# EAGLE design 187 lamp wall Dec 2016 (EAGLE 7.1.0)
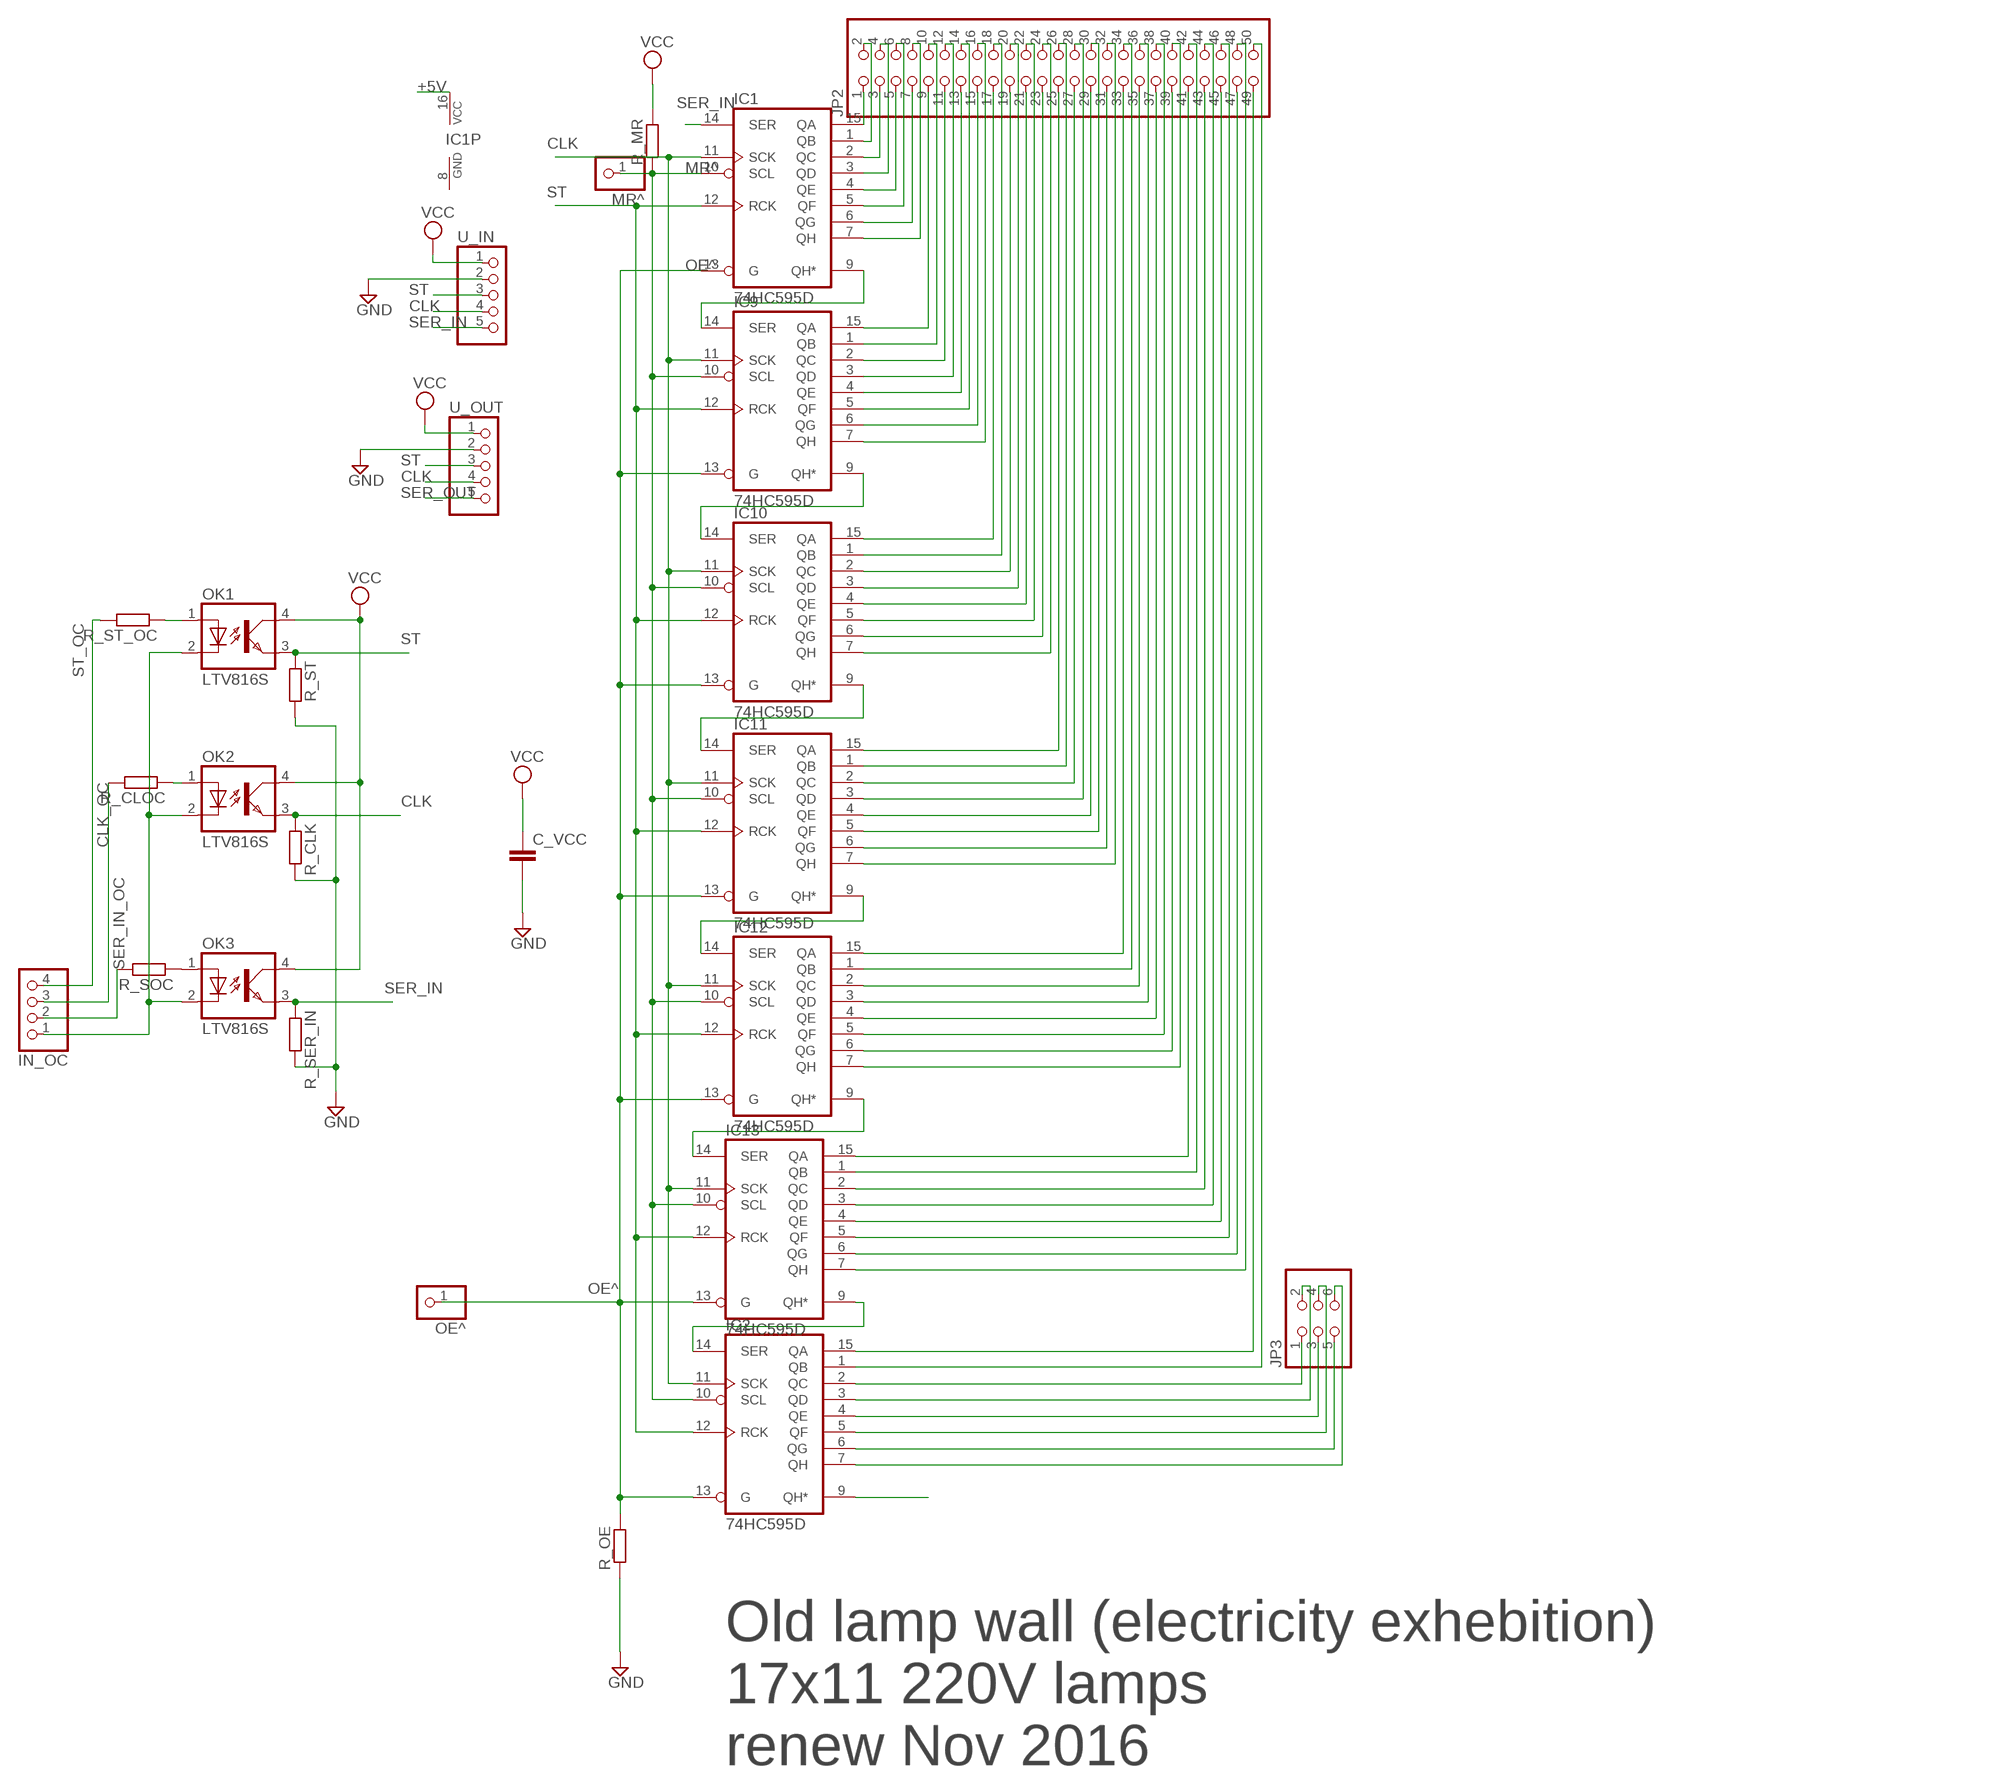
[diagram p0: schematic, sheet 1]

## Parts
C_VCC  C-EUC0603  [C0603]
IC1  74HC595D  [SO16]
IC2  74HC595D  [SO16]
IC9  74HC595D  [SO16]
IC10  74HC595D  [SO16]
IC11  74HC595D  [SO16]
IC12  74HC595D  [SO16]
IC13  74HC595D  [SO16]
IN_OC  PINHD-1X4SMALL_PADS  [1X4MARKED_SMALL]
JP2  PINHD-2X25  [2X25]
JP3  PINHD-2X3  [2X03]
MR^  PINHD-1X1  [1X01]
OE^  PINHD-1X1  [1X01]
OK1  LTV816S  [SMD4]
OK2  LTV816S  [SMD4]
OK3  LTV816S  [SMD4]
R_CLK  R-EU_R0603  [R0603]
R_CLOC  R-EU_R0603  [R0603]
R_MR  R-EU_R0603  [R0603]
R_OE  R-EU_R0603  [R0603]
R_SER_IN  R-EU_R0603  [R0603]
R_SOC  R-EU_R0603  [R0603]
R_ST  R-EU_R0603  [R0603]
R_ST_OC  R-EU_R0603  [R0603]
U_IN  PIN_HEAD_1X5_MARKEDSMAOLPAD  [1X5_MARKED_SMALL_PADS]
U_OUT  PIN_HEAD_1X5_MARKEDSMAOLPAD  [1X5_MARKED_SMALL_PADS]

## Nets
+5V: C_VCC.1 IC1.16(VCC) OK1.4(COL) OK2.4(COL) OK3.4(COL) R_MR.2 U_IN.1 U_OUT.1 ; supply symbol labelled VCC
CLK: IC1.11(SCK) IC2.11(SCK) IC9.11(SCK) IC10.11(SCK) IC11.11(SCK) IC12.11(SCK) IC13.11(SCK) OK2.3(EMIT) R_CLK.1 U_IN.4 U_OUT.4
CLK_OC: IN_OC.3 R_CLOC.2
GND: C_VCC.2 R_CLK.2 R_OE.1 R_SER_IN.2 R_ST.2 U_IN.2 U_OUT.2
MR^: IC1.10(SCL) IC2.10(SCL) IC9.10(SCL) IC10.10(SCL) IC11.10(SCL) IC12.10(SCL) IC13.10(SCL) MR^.1 R_MR.1
N$1: IC2.15(QA) JP2.49
N$2: IC2.1(QB) JP2.50
N$3: IC1.15(QA) JP2.1
N$4: IC2.2(QC) JP3.1
N$5: IC1.1(QB) JP2.2
N$6: IC2.3(QD) JP3.2
N$7: IC2.4(QE) JP3.3
N$8: IC2.5(QF) JP3.4
N$9: IC2.6(QG) JP3.5
N$10: IC2.7(QH) JP3.6
N$11: IC2.14(SER) IC13.9(QH*)
N$12: OK2.1(A) R_CLOC.1
N$13: IC1.2(QC) JP2.3
N$14: IC1.3(QD) JP2.4
N$15: IC1.4(QE) JP2.5
N$16: OK1.1(A) R_ST_OC.1
N$18: IC1.5(QF) JP2.6
N$19: IC1.6(QG) JP2.7
N$20: IC1.7(QH) JP2.8
N$21: IC1.9(QH*) IC9.14(SER)
N$23: OK3.1(A) R_SOC.1
N$24: IC9.15(QA) JP2.9
N$26: IC9.1(QB) JP2.10
N$27: IC9.2(QC) JP2.11
N$28: IC9.3(QD) JP2.12
N$29: IC9.4(QE) JP2.13
N$30: IN_OC.1 OK1.2(C) OK2.2(C) OK3.2(C)
N$32: IC9.5(QF) JP2.14
N$74: IC9.6(QG) JP2.15
N$75: IC9.7(QH) JP2.16
N$76: IC9.9(QH*) IC10.14(SER)
N$77: IC10.15(QA) JP2.17
N$78: IC10.1(QB) JP2.18
N$79: IC10.2(QC) JP2.19
N$80: IC10.3(QD) JP2.20
N$81: IC10.4(QE) JP2.21
N$82: IC10.5(QF) JP2.22
N$83: IC10.6(QG) JP2.23
N$84: IC10.7(QH) JP2.24
N$85: IC11.15(QA) JP2.25
N$86: IC11.1(QB) JP2.26
N$87: IC11.2(QC) JP2.27
N$88: IC11.3(QD) JP2.28
N$89: IC11.4(QE) JP2.29
N$90: IC11.5(QF) JP2.30
N$91: IC11.6(QG) JP2.31
N$92: IC11.7(QH) JP2.32
N$93: IC12.15(QA) JP2.33
N$94: IC12.1(QB) JP2.34
N$95: IC12.2(QC) JP2.35
N$96: IC12.3(QD) JP2.36
N$97: IC12.4(QE) JP2.37
N$98: IC12.5(QF) JP2.38
N$100: IC12.7(QH) JP2.40
N$101: IC13.15(QA) JP2.41
N$102: IC13.1(QB) JP2.42
N$103: IC13.2(QC) JP2.43
N$104: IC13.3(QD) JP2.44
N$105: IC13.4(QE) JP2.45
N$106: IC13.5(QF) JP2.46
N$107: IC13.6(QG) JP2.47
N$108: IC13.7(QH) JP2.48
N$109: IC10.9(QH*) IC11.14(SER)
N$118: IC11.9(QH*) IC12.14(SER)
N$125: IC12.6(QG) JP2.39
N$128: IC12.9(QH*) IC13.14(SER)
OE^: IC1.13(G) IC2.13(G) IC9.13(G) IC10.13(G) IC11.13(G) IC12.13(G) IC13.13(G) OE^.1 R_OE.2
SER_IN: IC1.14(SER) OK3.3(EMIT) R_SER_IN.1 U_IN.5
SER_IN_OC: IN_OC.2 R_SOC.2
SER_OUT: IC2.9(QH*) U_OUT.5
ST: IC1.12(RCK) IC2.12(RCK) IC9.12(RCK) IC10.12(RCK) IC11.12(RCK) IC12.12(RCK) IC13.12(RCK) OK1.3(EMIT) R_ST.1 U_IN.3 U_OUT.3
ST_OC: IN_OC.4 R_ST_OC.2

## Notes on the sheet
- Old lamp wall (electricity exhebition) 
  17x11 220V lamps
  renew Nov 2016

## Power pins joined to a net without a drawn wire
+5V: IC2.16(VCC) IC9.16(VCC) IC10.16(VCC) IC11.16(VCC) IC12.16(VCC) IC13.16(VCC)
GND: IC1.8(GND) IC2.8(GND) IC9.8(GND) IC10.8(GND) IC11.8(GND) IC12.8(GND) IC13.8(GND)

## Library data of the parts
C_VCC = rcl:C-EU: CAPACITOR, European symbol
IC1 IC2 IC9-IC13 = 74xx-eu:74*595: 8-bit SHIFT REGISTER, output latch
IN_OC = Amir_May_15:PINHD-1X4: PIN HEADER
JP2 = pinhead:PINHD-2X25: PIN HEADER
JP3 = pinhead:PINHD-2X3: PIN HEADER
MR^ OE^ = pinhead:PINHD-1X1: PIN HEADER
OK1-OK3 = optocoupler:LTV816: OPTO COUPLER Source: LITEON, LTV816.pdf; OC_FARNELL: unknown; OC_NEWARK: unknown
R_CLK R_CLOC R_MR R_OE R_SER_IN R_SOC R_ST R_ST_OC = rcl:R-EU_: RESISTOR, European symbol
U_IN U_OUT = Amir_May_15:PIN_HEAD_1X5_MARKED

## Board
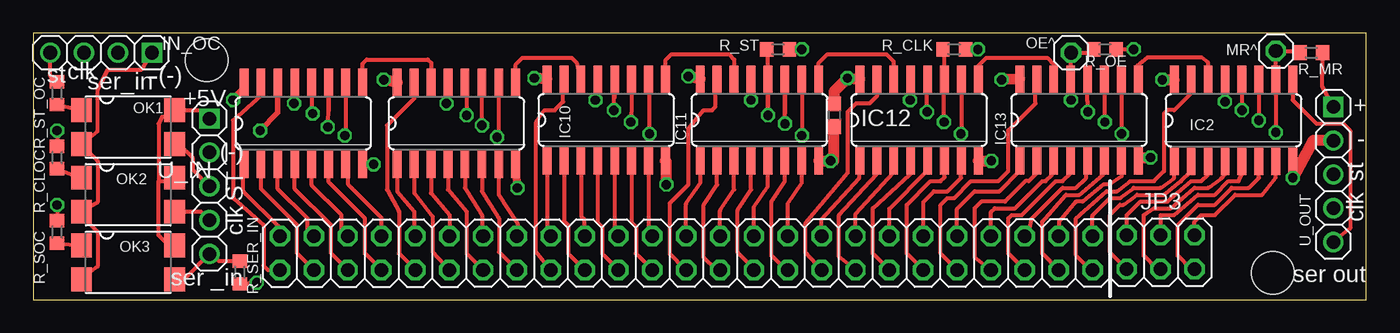
[diagram p1: board, top side]
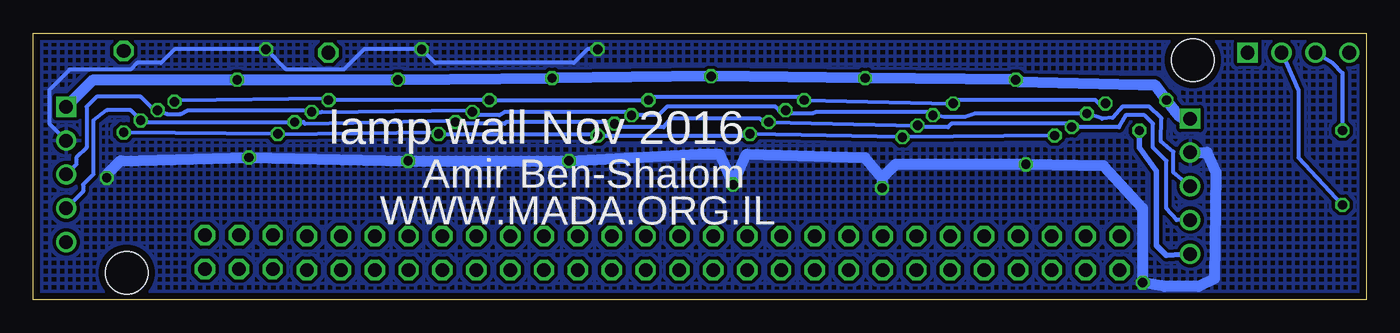
[diagram p2: board, bottom side, seen from below]

Size 100 x 20 mm. Coordinates in mm from the lower left corner, seen from the top.
Outline: 0,0 100,0 100,20 0,20 0,0
Copper layers (1*16): Top 0.035mm / dielectric 1.5mm / Bottom 0.035mm
Design rules "Smart-prototyping": minimum track width 7mil, minimum drill 12mil, track to track 7mil, track to pad 7mil, pad to pad 7mil, via to via 7mil, smd to smd 0mil, copper to edge 20mil, drill to drill 10mil, minimum pad ring 10mil, minimum via ring 6mil, stop-mask expansion 2mil, vias tented up to drill 25mil, thermal gap 10mil
Holes 3.2 mm at 93,2 13,18

### Footprints (pad centres in the part's own frame; a part is rotated, then mirrored left to right if it is on the bottom)
C0603 = smd 1.1 x 1: 1 -0.85,0; 2 0.85,0
SO16 = smd 0.66 x 2.032: 1 -4.445,-3.073; 2 -3.175,-3.073; 3 -1.905,-3.073; 4 -0.635,-3.073; 5 0.635,-3.073; 6 1.905,-3.073; 7 3.175,-3.073; 8 4.445,-3.073; 9 4.445,3.073; 10 3.175,3.073; 11 1.905,3.073; 12 0.635,3.073; 13 -0.635,3.073; 14 -1.905,3.073; 15 -3.175,3.073; 16 -4.445,3.073
1X4MARKED_SMALL = drill 1.016 square: 1 -3.81,0 | drill 1.016: 2 -1.27,0; 3 1.27,0; 4 3.81,0
2X25 = drill 1.016 octagon: 1 -30.48,-1.27; 2 -30.48,1.27; 3 -27.94,-1.27; 4 -27.94,1.27; 5 -25.4,-1.27; 6 -25.4,1.27; 7 -22.86,-1.27; 8 -22.86,1.27; 9 -20.32,-1.27; 10 -20.32,1.27; 11 -17.78,-1.27; 12 -17.78,1.27; 13 -15.24,-1.27; 14 -15.24,1.27; 15 -12.7,-1.27; 16 -12.7,1.27; 17 -10.16,-1.27; 18 -10.16,1.27; 19 -7.62,-1.27; 20 -7.62,1.27; 21 -5.08,-1.27; 22 -5.08,1.27; 23 -2.54,-1.27; 24 -2.54,1.27; 25 0,-1.27; 26 0,1.27; 27 2.54,-1.27; 28 2.54,1.27; 29 5.08,-1.27; 30 5.08,1.27; 31 7.62,-1.27; 32 7.62,1.27; 33 10.16,-1.27; 34 10.16,1.27; 35 12.7,-1.27; 36 12.7,1.27; 37 15.24,-1.27; 38 15.24,1.27; 39 17.78,-1.27; 40 17.78,1.27; 41 20.32,-1.27; 42 20.32,1.27; 43 22.86,-1.27; 44 22.86,1.27; 45 25.4,-1.27; 46 25.4,1.27; 47 27.94,-1.27; 48 27.94,1.27; 49 30.48,-1.27; 50 30.48,1.27
2X03 = drill 1.016 octagon: 1 -2.54,-1.27; 2 -2.54,1.27; 3 0,-1.27; 4 0,1.27; 5 2.54,-1.27; 6 2.54,1.27
1X01 = drill 1.016 octagon: 1 0,0
SMD4 = smd 1.78 x 1.55: 1 -1.27,-3.5; 2 1.27,-3.5; 3 1.27,3.5; 4 -1.27,3.5
R0603 = smd 1 x 1.1: 1 -0.85,0; 2 0.85,0
1X5_MARKED_SMALL_PADS = drill 1.016 square: 1 -5.08,0 | drill 1.016: 2 -2.54,0; 3 0,0; 4 2.54,0; 5 5.08,0

### Placement (x,y rotation side)
C_VCC  60.1,13.85 270 top
IC1  20.25,13.24 0 top
IC2  90.04,13.46 0 top
IC9  31.75,13.24 0 top
IC10  42.98,13.49 0 top
IC11  54.48,13.49 0 top
IC12  66.46,13.49 0 top
IC13  78.46,13.49 0 top
IN_OC  5.08,18.54 180 top
JP2  48.98,3.49 0 top
JP3  84.58,3.56 0 top
MR^  93.22,18.67 0 top
OE^  77.85,18.54 0 top
OK1  7.11,12.95 270 top
OK2  7.11,7.87 270 top
OK3  7.11,2.79 270 top
R_CLK  69.09,18.8 0 top
R_CLOC  1.78,10.67 90 top
R_MR  95.89,18.54 0 top
R_OE  80.39,18.8 180 top
R_SER_IN  15.49,2.03 270 top
R_SOC  1.78,5.08 90 top
R_ST  55.88,18.8 0 top
R_ST_OC  1.78,15.49 90 top
U_IN  13.21,8.51 270 top
U_OUT  97.54,9.4 270 top

### Tracks (layer width: path | path; a pad name or v marks a point on that pad's centre or on a via)
+5V  (via drill 0.7)
  Top 0.305: U_OUT.1 96.72,15.99 R_MR.2 | 85.57,16.51 IC2.16 | 9.4,8.89 9.4,13.21 9.65,13.72 OK1.4 12.57,14.22 U_IN.1 | 9.4,8.89 10.36,8.89 OK2.4 | OK3.4 10.16,4.06 9.4,4.83 9.4,8.89
  Top 0.61: IC1.16 15.81,15.81 v14.99,14.99
  Top 0.813: IC13.16 v72.64,16.51 | IC12.16 v61.09,16.64 60.1,15.65 C_VCC.1 | IC11.16 v49.15,16.76 | IC10.16 v37.59,16.64 | IC9.16 v26.29,16.51 | v84.71,16.51 85.57,16.51
  Bottom 0.305: v26.29,16.51 26.16,16.38
  Bottom 0.406: 12.7,14.1 U_IN.1
  Bottom 0.813: v26.29,16.51 v37.59,16.64 v49.15,16.76 v61.09,16.64 v72.64,16.51 v84.71,16.51 95.5,16.51 U_OUT.1 | 26.16,16.38 17.02,16.13 15.88,16.13 v14.99,14.99 13.97,13.72 U_IN.1
CLK  (via drill 0.7)
  Top 0.305: v22.1,12.95 IC1.11 22.16,14.16 | v33.66,13.08 IC9.11 | v44.83,13.34 44.89,14.79 IC10.11 44.89,14.17 | IC13.11 80.36,13.82 v80.39,13.34 | v68.33,13.34 68.33,16.53 IC12.11 68.36,18.67 R_CLK.1 | v56.39,13.21 56.39,16.56 IC11.11 56.38,13.98 | IC2.11 v91.95,13.46 | OK2.3 12.57,6.6 U_IN.4
  Bottom 0.305: U_IN.4 14.22,5.97 14.99,6.86 14.99,10.41 16,11.43 16,13.21 16.64,13.84 18.03,13.84 18.54,12.95 v22.1,12.95 22.35,13.21 31.11,13.21 31.37,12.95 33.4,12.95 v33.66,13.08 v44.83,13.34 45.21,13.34 45.47,13.59 52.2,13.59 52.7,12.95 56.26,12.95 v56.39,13.21 56.9,13.21 57.02,13.34 64.52,13.34 64.64,13.21 68.2,13.21 v68.33,13.34 68.58,13.46 79.63,13.21 79.76,13.34 v80.39,13.34 91.44,13.34 v91.95,13.46 92.71,14.22 94.49,14.22 95.5,13.46 95.5,9.4 96.27,8.64 96.27,8.13 U_OUT.4
CLK_OC  (via drill 0.7)
  Top 0.305: v1.78,12.7 R_CLOC.2
  Bottom 0.305: IN_OC.3 2.54,17.78 1.78,17.02 v1.78,12.7
GND  (via drill 0.7)
  Top 0.305: IC1.8 25.14,10.16 v25.53,10.16 | IC9.8 | 60.07,10.42 v59.82,10.41 | v71.88,10.42 v71.88,10.41 | IC13.8 83.19,10.67 | 60.07,12.96 C_VCC.2 | R_OE.1 v82.55,18.8 | R_CLK.2 v70.87,18.8 | R_ST.2 v57.66,18.8 | R_SER_IN.2 16.26,1.27 v16.76,1.27
  Top 0.61: v36.32,8.38 IC9.8 | IC2.8 v94.49,9.14
  Top 0.813: IC11.8 60.07,10.42 60.07,12.96 | IC12.8 v71.88,10.42 | 83.19,10.67 v83.82,10.67 | U_OUT.2 96.04,11.94 96.04,11.96 v94.49,9.14 | v47.5,8.64 47.5,10.35 IC10.8
  Bottom 0.305: v83.82,10.67 85.47,10.67 | U_OUT.2 98.81,13.21 98.81,15.75 97.28,17.27 92.71,17.27 92.2,17.78 90.42,17.78 89.41,18.8 v82.55,18.8 81.03,17.27 76.71,17.27 75.18,18.8 v70.87,18.8 69.85,17.78 59.44,17.78 58.42,18.8 v57.66,18.8
  Bottom 0.813: 36.32,9.14 35.31,10.16 v25.53,10.16 19.68,10.03 16.76,6.86 v16.76,1.27 15.11,0.99 12.57,0.99 11.38,1.57 11.28,9.55 11.94,11.05 U_IN.2 | 36.32,9.14 37.59,10.67 46.48,10.92 v47.5,8.64 48.51,10.92 50.04,10.92 v59.82,10.41 v71.88,10.41 v83.82,10.67 93.47,10.41 94.49,9.4 v94.49,9.14 | 36.32,9.14 v36.32,8.38
  pour Bottom (isolate 0.254, hatched): 0,0 0,20 100,20 100,0
MR^  (via drill 0.7)
  Top 0.305: IC11.10 57.65,12.07 v57.66,12.32 | v46.23,12.45 46.23,16.5 IC10.10 | IC9.10 34.92,12.44 v34.8,12.19 | IC1.10 23.43,12.38 v23.37,12.32 | IC12.10 69.64,12.99 v69.6,12.45 | IC13.10 81.64,12.6 v81.66,12.45 | v93.22,12.56 IC2.10 MR^.1 94.91,18.67 R_MR.1
  Bottom 0.305: v23.37,12.32 v34.8,12.19 v46.23,12.45 46.23,12.32 v57.66,12.32 57.78,12.45 v69.6,12.45 69.72,12.57 v81.66,12.45 v93.22,12.56 92.72,12.55
N$1
  Top 0.305: IC2.15 86.87,15.49 85.6,14.22 85.09,14.22 84.84,13.97 84.84,9.65 84.07,8.89 82.3,8.89 81.28,8.13 80.52,8.13 78.23,6.1 78.23,3.3 79.31,2.22 JP2.49
N$2
  Top 0.305: IC2.1 85.6,9.14 84.58,8.38 82.55,8.38 81.53,7.62 80.77,7.62 79.46,6.31 JP2.50
N$3
  Top 0.305: IC1.15 17.08,15.3 14.99,13.46 14.99,7.62 17.27,5.59 17.27,2.54 17.59,2.22 JP2.1
N$4
  Top 0.305: JP3.1 80.77,3.56 80.77,6.35 81.53,7.11 81.79,7.11 82.8,7.87 84.84,7.87 86.11,8.89 86.87,9.65 IC2.2
N$5
  Top 0.305: JP2.2 18.5,5.37 15.75,8.13 15.75,10.1 IC1.1
N$6
  Top 0.305: IC2.3 88.14,9.4 87.63,8.89 86.87,8.89 85.09,7.37 83.06,7.37 82.04,6.35 JP3.2
N$7
  Top 0.305: JP3.3 84.33,2.29 83.31,3.3 83.31,6.35 84.07,6.86 85.34,6.86 87.12,8.38 88.14,8.38 89.15,9.14 89.41,9.4 IC2.4
N$8
  Top 0.305: JP3.4 84.58,6.35 85.6,6.35 87.38,7.87 88.65,7.87 89.66,8.89 90.42,8.89 90.68,9.4 IC2.5
N$9
  Top 0.305: JP3.5 86.87,2.29 85.85,3.3 85.85,5.59 87.38,7.11 88.65,7.11 89.92,8.38 91.19,8.38 91.95,9.14 IC2.6
N$10
  Top 0.305: JP3.6 87.12,5.84 87.63,6.35 88.65,6.35 90.17,7.87 92.2,7.87 93.22,9.14 IC2.7
N$11
  Top 0.305: IC2.14 88.14,17.78 87.66,18.19 83.59,18.19 82.8,17.53 82.8,16.67 IC13.9
N$12
  Top 0.305: R_CLOC.1 OK2.1
N$13
  Top 0.305: JP2.3 19.81,3.45 19.81,5.59 17.08,8.32 IC1.2
N$14
  Top 0.305: JP2.4 20.57,5.23 20.57,6.1 18.35,8.32 IC1.3
N$15
  Top 0.305: JP2.5 22.35,3.45 22.35,5.59 19.62,8.32 IC1.4
N$16
  Top 0.305: R_ST_OC.1 OK1.1
N$18
  Top 0.305: JP2.6 23.11,5.23 23.11,6.35 20.89,8.57 IC1.5
N$19
  Top 0.305: JP2.7 24.89,3.45 24.89,6.1 22.16,8.83 IC1.6
N$20
  Top 0.305: JP2.8 26.12,6.13 23.62,8.64 23.62,9.97 IC1.7
N$21
  Top 0.305: IC1.9 24.7,17.71 25.02,18.03 29.59,18.03 29.84,17.78 IC9.14
N$23
  Top 0.305: R_SOC.1 OK3.1
N$24
  Top 0.305: IC9.15 28.57,15.11 26.54,13.08 26.54,8.26 27.43,6.6 27.43,3.45 JP2.9
N$26
  Top 0.305: IC9.1 27.3,8.13 28.57,6.6 28.57,4.85 JP2.10
N$27
  Top 0.305: IC9.2 28.57,8.01 29.97,6.22 29.97,3.58 JP2.11
N$28
  Top 0.305: IC9.3 29.84,8.01 31.24,6.35 31.24,4.8 JP2.12
N$29
  Top 0.305: IC9.4 31.11,8.26 32.51,6.6 32.51,3.45 JP2.13
N$30
  Top 0.305: OK3.2 4.83,2.48 4.83,5.08 3.87,6.04 OK2.2 4.83,7.31 4.83,10.41 OK1.2 4.83,12.64 4.83,15.75 5.59,17.27 8.13,17.27 IN_OC.1
N$32
  Top 0.305: IC9.5 32.38,8.39 33.66,6.35 33.66,4.85 JP2.14
N$74
  Top 0.305: IC9.6 33.65,8.13 34.92,6.1 34.92,3.58 JP2.15
N$75
  Top 0.305: IC9.7 34.92,7.88 36.32,5.71 36.32,4.8 JP2.16
N$76
  Top 0.305: IC9.9 36.19,17.65 36.7,18.16 40.39,18.16 40.77,17.78 41.02,16.62 IC10.14
N$77
  Top 0.305: JP2.17 37.72,3.58 37.72,13.34 38.35,14.22 39.12,14.22 39.75,14.86 39.75,16.51 IC10.15 39.75,16.62
N$78
  Top 0.305: IC10.1 38.54,5.05 JP2.18
N$79
  Top 0.305: IC10.2 39.81,5.91 40.13,5.59 40.13,3.45 JP2.19
N$80
  Top 0.305: JP2.20 41.36,6.01 41.15,6.22 41.15,10.35 IC10.3
N$81
  Top 0.305: IC10.4 42.35,5.78 42.67,5.46 42.67,3.45 JP2.21
N$82
  Top 0.305: IC10.5 43.62,5.05 JP2.22
N$83
  Top 0.305: IC10.6 44.89,5.78 45.21,5.46 45.21,3.45 JP2.23
N$84
  Top 0.305: IC10.7 46.16,5.05 JP2.24
N$85
  Top 0.305: JP2.25 48.98,2.25 49.02,2.29 48.9,2.29 47.75,3.43 47.75,7.24 49.15,8.64 49.15,12.83 50.29,14.22 50.93,14.22 51.18,14.48 51.18,16.45 IC11.15
N$86
  Top 0.305: JP2.26 48.98,7.2 50.04,8.76 IC11.1
N$87
  Top 0.305: JP2.27 51.24,2.22 50.29,3.17 50.29,7.11 51.31,8.64 IC11.2
N$88
  Top 0.305: JP2.28 51.52,6.69 52.58,8.26 IC11.3
N$89
  Top 0.305: JP2.29 54.06,2.32 52.83,3.56 52.83,6.73 53.85,8.26 IC11.4
N$90
  Top 0.305: JP2.30 54.06,6.95 55.12,8.51 IC11.5
N$91
  Top 0.305: JP2.31 56.45,2.22 55.37,3.3 55.37,7.37 56.39,8.89 IC11.6
N$92
  Top 0.305: JP2.32 56.6,7.2 57.66,8.76 IC11.7
N$93
  Top 0.305: IC12.15 63.28,15.28 62.74,14.73 61.72,14.73 61.09,14.1 61.09,9.53 57.91,5.71 57.91,3.58 JP2.33
N$94
  Top 0.305: JP2.34 59.14,6.02 61.98,9.14 62.02,9.69 IC12.1
N$95
  Top 0.305: JP2.35 60.45,3.2 60.45,6.35 63.28,9.44 IC12.2
N$96
  Top 0.305: IC12.3 64.56,9.56 61.68,6.44 JP2.36
N$97
  Top 0.305: JP2.37 62.99,3.45 62.99,6.86 65.79,9.4 IC12.4
N$98
  Top 0.305: JP2.38 64.22,6.82 67.06,9.65 67.06,10.38 IC12.5
N$100
  Top 0.305: JP2.40 66.76,7.33 67.56,8.13 68.58,8.13 69.6,9.14 69.6,10.38 IC12.7
N$101
  Top 0.305: JP2.41 68.07,3.45 68.07,7.11 68.58,7.62 69.09,7.62 70.36,8.89 72.39,8.89 73.15,9.65 73.15,12.7 75.18,14.73 75.18,16.46 IC13.15
N$102
  Top 0.305: IC13.1 74.02,9.68 72.47,8.13 70.61,8.13 69.3,6.82 JP2.42
N$103
  Top 0.305: IC13.2 75.28,9.5 74.68,8.89 74.42,8.89 72.9,7.37 71.12,7.37 70.61,6.86 70.61,3.2 JP2.43
N$104
  Top 0.305: JP2.44 71.84,6.57 72.14,6.86 73.66,6.86 75.69,8.89 75.95,8.89 76.45,9.4 76.45,10.32 IC13.3
N$105
  Top 0.305: JP2.45 73.15,3.45 73.15,6.1 73.41,6.35 74.17,6.35 76.71,8.89 77.22,8.89 77.83,9.5 IC13.4
N$106
  Top 0.305: JP2.46 74.68,5.05 74.93,6.1 77.22,8.38 78.23,8.38 78.99,9.14 78.99,10.32 IC13.5
N$107
  Top 0.305: JP2.47 75.69,3.45 75.69,5.84 77.47,7.87 78.49,7.87 80.26,9.4 80.26,10.32 IC13.6
N$108
  Top 0.305: IC13.7 81.64,9.24 80.77,8.64 80.26,8.64 78.74,7.37 78.23,7.37 76.96,5.84 76.96,4.8 JP2.48
N$109
  Top 0.305: IC10.9 47.43,17.96 47.88,18.41 52.2,18.41 52.58,18.03 IC11.14
N$118
  Top 0.305: IC11.9 58.92,17.77 59.56,18.41 64.01,18.41 64.52,17.91 64.52,16.6 IC12.14
N$125
  Top 0.305: JP2.39 65.53,3.45 65.53,7.11 67.31,8.89 68.07,8.89 68.36,9.18 IC12.6
N$128
  Top 0.305: IC12.9 70.91,17.57 71.5,18.16 76.07,18.16 76.58,17.65 76.58,16.59 IC13.14
OE^  (via drill 0.7)
  Top 0.305: IC2.13 v89.41,14.86 | v77.85,14.99 IC13.13 77.83,18.52 OE^.1 79.8,18.54 R_OE.2 | IC1.13 19.62,14.79 v19.56,14.73 | v30.99,14.73 30.99,16.19 IC9.13 | IC10.13 42.35,15.17 v42.16,14.99 | IC11.13 v53.84,14.99 v53.85,14.99 | v65.79,14.99 65.83,15.03 IC12.13 65.83,15.71
  Bottom 0.305: v89.41,14.86 89.03,14.99 78.11,15.11 v77.85,14.99 v65.79,14.99 v53.85,14.99 53.59,15.24 42.42,15.24 v42.16,14.99 v30.99,14.73 30.73,14.99 20.32,14.99 20.07,14.73 v19.56,14.73
SER_IN  (via drill 0.7)
  Top 0.305: OK3.3 11.3,1.52 U_IN.5 13.93,2.88 R_SER_IN.1
  Top 0.406: IC1.14 18.35,14.03 v17.02,12.7
  Bottom 0.406: v17.02,12.7 17.02,11.43 15.75,9.65 15.75,4.06 14.99,3.3 U_IN.5
SER_IN_OC  (via drill 0.7)
  Top 0.305: v1.78,7.11 R_SOC.2
  Bottom 0.305: IN_OC.2 5.08,15.75 5.08,10.67 v1.78,7.11
SER_OUT
  Top 0.305: IC2.9 94.49,14.99 96.27,13.21 98.3,13.21 98.81,12.7 98.81,5.33 U_OUT.5
ST  (via drill 0.7)
  Top 0.305: IC1.12 20.89,14.16 v20.95,13.97 | IC9.12 32.51,16.18 v32.51,13.84 | v79.12,14.1 79.09,14.88 IC13.12 | v67.06,14.1 67.06,16.53 IC12.12 | v43.56,14.22 43.56,16.51 IC10.12 43.62,15.18 | v55.12,13.84 55.12,16.56 IC11.12 | IC11.12 55.11,14.48 | IC2.12 v90.68,14.22 | IC11.12 55.11,18.71 R_ST.1 | OK1.3 10.92,11.68 11.94,10.67 11.94,9.78 U_IN.3
  Bottom 0.305: U_IN.3 14.45,9.55 14.45,11.1 15.39,11.89 15.37,13.61 16.26,14.48 18.29,14.48 19.02,13.66 19.81,13.59 v20.95,13.97 29.34,13.97 30.1,13.72 31.62,13.72 v32.51,13.84 32.77,14.1 41.27,14.1 41.53,13.97 43.18,13.97 v43.56,14.22 44.07,14.22 44.32,14.48 52.45,14.48 53.09,13.84 v55.12,13.84 55.24,13.84 55.5,14.1 64.64,14.1 65.02,13.84 66.67,13.84 v67.06,14.1 67.44,14.22 78.36,14.1 v79.12,14.1 79.76,14.22 88.39,14.22 88.95,13.95 89.97,13.95 v90.68,14.22 90.93,14.22 91.95,15.24 95.25,15.24 96.01,14.48 96.01,11.43 96.77,10.67 96.77,10.16 U_OUT.3
ST_OC
  Top 0.305: R_ST_OC.2 1.69,16.34 1.27,16.76 IN_OC.4

### Text on the board
tNames: - | clk | st | ser_in | (-) | +5V | + | (-) | - | st | ST | clk | clk | ser _in | ser out
bNames: lamp wall Nov 2016 | Amir Ben-Shalom | WWW.MADA.ORG.IL